# EasyEDA schematic Schematic_TuYa_led_driver.json
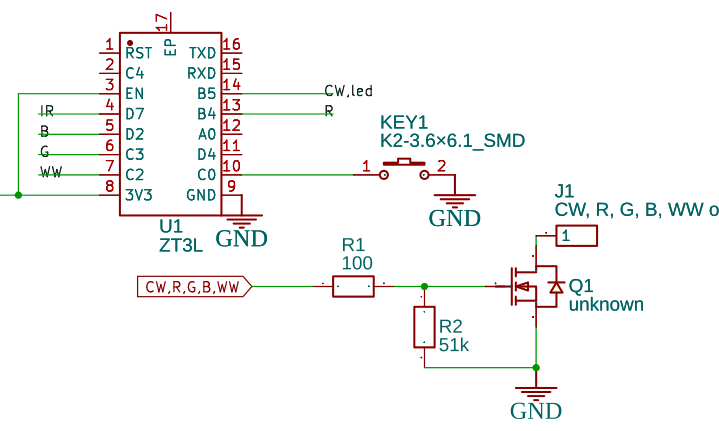
[diagram p0: schematic sheet]

## Parts
J1  CW, R, G, B, WW out  [HDR-M-2.54_1X1]
KEY1  K2-3.6×6.1_SMD  [KEY-SMD_2P-L6.2-W3.6-LS8.0]
Q1  unknown  [SOT-23_L2.9-W1.3-P0.95-LS2.4-BR]
R1  100  [R0603]
R2  51k  [R0603]
U1  ZT3L  [WIRELM-SMD_16P-L24.0-W16.0-P2.00]

## Library data of the parts
J1 = HDR-M-2.54_1x1: Supplier Part: C81276; Supplier: LCSC; Contributor: LCEDA_Lib
KEY1 = K2-3.6×6.1_SMD: Supplier Part: C118141; Supplier: LCSC; Manufacturer Part: K2-1107ST-A4SW-06; Contributor: LCEDA_Lib; 制造商: 韩国韩荣
Q1 = 2N7002: Supplier: LCSC; Manufacturer: Nexperia; Manufacturer Part: 2N7002,215; image: //image.lceda.cn/szlcsc/C65189.jpg; Supplier Part: C65189; Paste Type: expand; Contributor: LCEDA_Lib
R1 R2 = R_0603_EU: Contributor: LCEDA_Lib
U1 = ZT3L: Supplier: LCSC; Supplier Part: C2897596; Manufacturer: YTL(亚特联); link: https://atta.szlcsc.com/upload/public/pdf/source/20211124/140CF4541799C161C976FB43E691C443.pdf; Contributor: lcsc

## Nets
3.3V: U1.3(EN) U1.8(3V3)
GND: KEY1.2 Q1.2(S) R2.2 U1.9(GND)
B: U1.5(D2)
CW,led: U1.14(B5)
CW,R,G,B,WW: R1.1
G: U1.6(C3)
IR: U1.4(D7)
R: U1.13(B4)
WW: U1.7(C2)
Net-(J1-1): J1.1 Q1.3(D)
Net-(KEY1-1): KEY1.1 U1.10(C0)
Net-(Q1-1): Q1.1(G) R1.2 R2.1

Not connected (* = marked no-connect by the designer): U1 1(RST) 2(C4) 11(D4) 12(A0) 15(RXD) 16(TXD) 17(EP)
